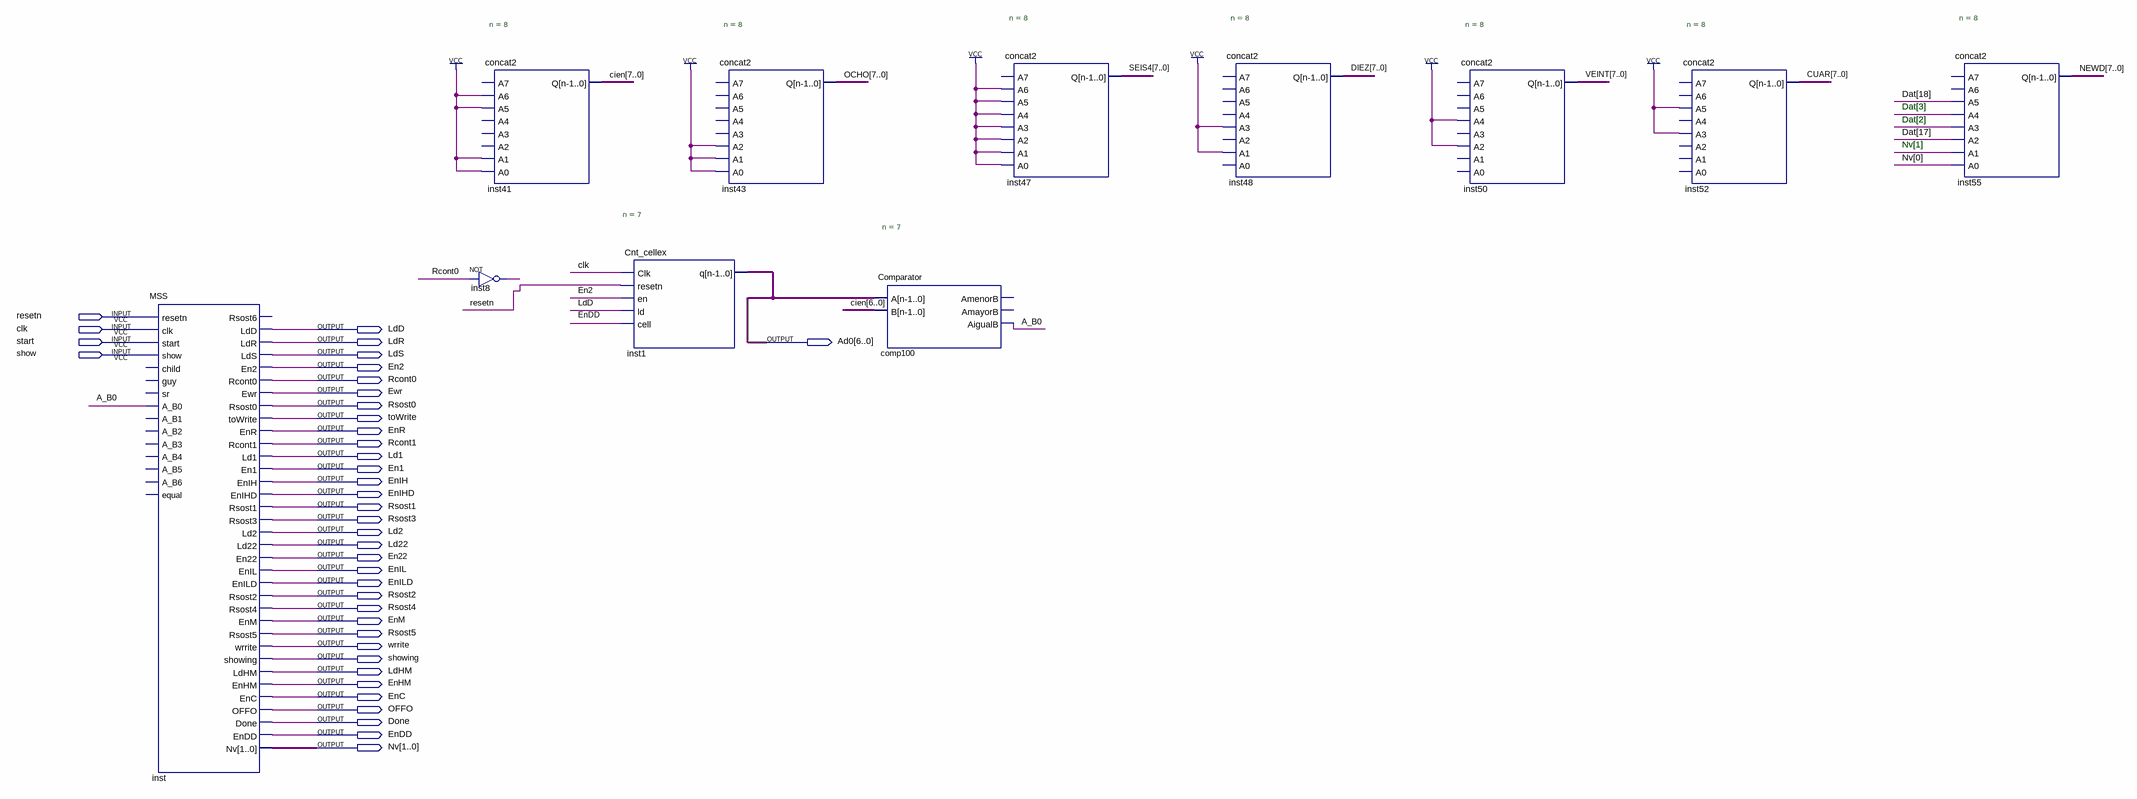
[diagram p0: schematic sheet]
// Quartus schematic prueba.bdf as structural Verilog: 11 symbols, 39 pins
module prueba (
  input  resetn,
  input  clk,
  input  start,
  input  show,
  output LdD,
  output LdR,
  output [6:0] Ad0,
  output LdS,
  output En2,
  output Rcont0,
  output Ewr,
  output Rsost0,
  output toWrite,
  output EnR,
  output Rcont1,
  output Ld1,
  output En1,
  output EnIH,
  output EnIHD,
  output Rsost1,
  output Rsost3,
  output Ld2,
  output Ld22,
  output En22,
  output EnIL,
  output EnILD,
  output Rsost2,
  output Rsost4,
  output EnM,
  output Rsost5,
  output wrrite,
  output showing,
  output LdHM,
  output EnHM,
  output EnC,
  output OFFO,
  output Done,
  output EnDD,
  output [1:0] Nv
);

  wire A_B0, inst8_out;
  wire [7:0] cien, CUAR, DIEZ, NEWD, OCHO, SEIS4, VEINT;
  wire [18:2] Dat;

  MSS inst (
    .resetn(resetn), .clk(clk), .start(start), .show(show), .A_B0(A_B0), .LdD(LdD), .LdR(LdR), .LdS(LdS),
    .En2(En2), .Rcont0(Rcont0), .Ewr(Ewr), .Rsost0(Rsost0), .toWrite(toWrite), .EnR(EnR), .Rcont1(Rcont1),
    .Ld1(Ld1), .En1(En1), .EnIH(EnIH), .EnIHD(EnIHD), .Rsost1(Rsost1), .Rsost3(Rsost3), .Ld2(Ld2),
    .Ld22(Ld22), .En22(En22), .EnIL(EnIL), .EnILD(EnILD), .Rsost2(Rsost2), .Rsost4(Rsost4), .EnM(EnM),
    .Rsost5(Rsost5), .wrrite(wrrite), .showing(showing), .LdHM(LdHM), .EnHM(EnHM), .EnC(EnC), .OFFO(OFFO),
    .Done(Done), .EnDD(EnDD), .Nv(Nv));  // open: child, guy, sr, A_B1, A_B2, A_B3, A_B4, A_B5, A_B6, equal, Rsost6
  concat2 #(.n(8)) inst41 (.A6(1'b1), .A5(1'b1), .A1(1'b1), .A0(1'b1), .Q(cien));  // open: A7, A4, A3, A2
  not inst8 (inst8_out, Rcont0);
  Cnt_cellex #(.n(7)) inst1 (.Clk(clk), .resetn(resetn), .en(En2), .ld(LdD), .\cell (EnDD), .q(Ad0));
  concat2 #(.n(8)) inst43 (.A2(1'b1), .A1(1'b1), .A0(1'b1), .Q(OCHO));  // open: A7, A6, A5, A4, A3
  Comparator #(.n(7)) comp100 (.A(Ad0), .B(cien[6:0]), .AigualB(A_B0));  // open: AmenorB, AmayorB
  concat2 #(.n(8)) inst47 (
    .A6(1'b1), .A5(1'b1), .A4(1'b1), .A3(1'b1), .A2(1'b1), .A1(1'b1), .A0(1'b1), .Q(SEIS4));  // open: A7
  concat2 #(.n(8)) inst48 (.A3(1'b1), .A1(1'b1), .Q(DIEZ));  // open: A7, A6, A5, A4, A2, A0
  concat2 #(.n(8)) inst50 (.A4(1'b1), .A2(1'b1), .Q(VEINT));  // open: A7, A6, A5, A3, A1, A0
  concat2 #(.n(8)) inst52 (.A5(1'b1), .A3(1'b1), .Q(CUAR));  // open: A7, A6, A4, A2, A1, A0
  concat2 #(.n(8)) inst55 (
    .A5(Dat[18]), .A4(Dat[3]), .A3(Dat[2]), .A2(Dat[17]), .A1(Nv[1]), .A0(Nv[0]), .Q(NEWD));  // open: A7, A6

  // Notes on the sheet:
  //   Dat[3]
  //   Dat[2]
  //   Nv[1]
endmodule
